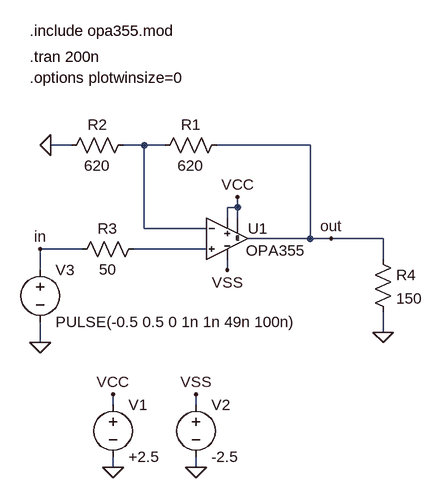
[diagram p0: schematic opa355_test.asc]
opa355_test.asc, the LTspice schematic file:
Version 4
SHEET 1 880 680
WIRE -128 32 -160 32
WIRE -16 32 -48 32
WIRE 16 32 -16 32
WIRE 240 32 96 32
WIRE 128 128 128 112
WIRE 128 128 112 128
WIRE 112 144 112 128
WIRE 128 144 128 128
WIRE -16 160 -16 32
WIRE 80 160 -16 160
WIRE 240 176 240 32
WIRE 240 176 144 176
WIRE 272 176 240 176
WIRE 352 176 272 176
WIRE -112 192 -176 192
WIRE 80 192 -32 192
WIRE 352 208 352 176
WIRE -176 224 -176 192
WIRE 112 224 112 208
WIRE 352 320 352 288
WIRE -176 336 -176 304
WIRE -64 432 -64 416
WIRE 64 432 64 416
WIRE -64 528 -64 512
WIRE 64 528 64 512
FLAG 128 112 VCC
FLAG 112 224 VSS
FLAG -160 32 0
FLAG -176 336 0
FLAG -64 528 0
FLAG 64 528 0
FLAG -64 416 VCC
FLAG 64 416 VSS
FLAG 272 176 out
FLAG -176 192 in
FLAG 352 320 0
SYMBOL voltage -64 416 R0
SYMATTR InstName V1
SYMATTR Value +2.5
SYMBOL voltage 64 416 R0
SYMATTR InstName V2
SYMATTR Value -2.5
SYMBOL xopamp_t2 112 176 R0
SYMATTR InstName U1
SYMATTR Value OPA355
SYMBOL res 0 48 R270
WINDOW 0 32 56 VTop 0
WINDOW 3 0 56 VBottom 0
SYMATTR InstName R1
SYMATTR Value 620
SYMBOL res -144 48 R270
WINDOW 0 32 56 VTop 0
WINDOW 3 0 56 VBottom 0
SYMATTR InstName R2
SYMATTR Value 620
SYMBOL voltage -176 208 R0
WINDOW 123 0 0 Left 0
WINDOW 39 0 0 Left 0
SYMATTR InstName V3
SYMATTR Value PULSE(-0.5 0.5 0 1n 1n 49n 100n)
SYMBOL res -128 208 R270
WINDOW 0 32 56 VTop 0
WINDOW 3 0 56 VBottom 0
SYMATTR InstName R3
SYMATTR Value 50
SYMBOL res 336 192 R0
SYMATTR InstName R4
SYMATTR Value 150
TEXT -192 -144 Left 0 !.include opa355.mod
TEXT -192 -104 Left 0 !.tran 200n
TEXT -192 -72 Left 0 !.options plotwinsize=0

The netlist it stands for:
* opa355_test.asc
V1 VCC 0 +2.5
V2 VSS 0 -2.5
XU1 out VSS N002 N001 VCC VCC OPA355  ; pins OUT V- In+ In- DIS V+
R1 N001 out 620
R2 0 N001 620
V3 in 0 PULSE(-0.5 0.5 0 1n 1n 49n 100n)
R3 in N002 50
R4 out 0 150
.include opa355.mod
.tran 200n
.options plotwinsize=0
.backanno
.end